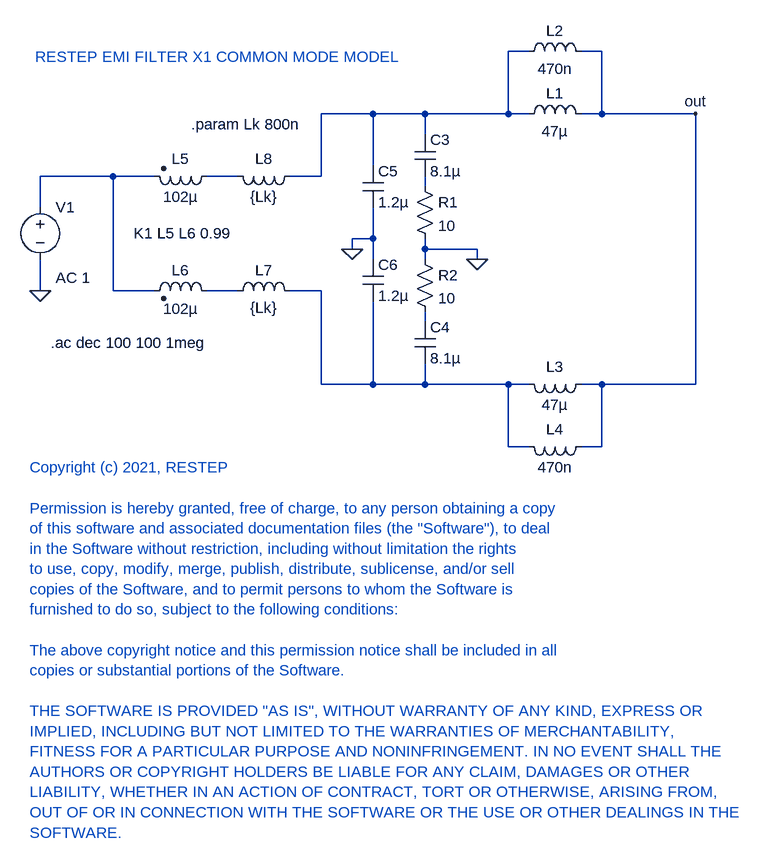
[diagram p0: schematic RESTEP EMI FILTER CM.asc]
RESTEP EMI FILTER CM.asc, the LTspice schematic file:
Version 4
SHEET 1 880 1176
WIRE 128 16 96 16
WIRE 240 16 208 16
WIRE -112 112 -192 112
WIRE -32 112 -112 112
WIRE 96 112 96 16
WIRE 96 112 -32 112
WIRE 128 112 96 112
WIRE 240 112 240 16
WIRE 240 112 208 112
WIRE 384 112 240 112
WIRE -32 144 -32 112
WIRE -112 192 -112 112
WIRE -512 208 -624 208
WIRE -448 208 -512 208
WIRE -320 208 -368 208
WIRE -192 208 -192 112
WIRE -192 208 -240 208
WIRE -32 224 -32 208
WIRE -624 256 -624 208
WIRE -112 304 -112 256
WIRE -112 304 -144 304
WIRE -144 320 -144 304
WIRE -32 320 -32 304
WIRE 48 320 -32 320
WIRE -112 336 -112 304
WIRE -32 336 -32 320
WIRE 48 336 48 320
WIRE -624 384 -624 336
WIRE -512 384 -512 208
WIRE -448 384 -512 384
WIRE -320 384 -368 384
WIRE -192 384 -240 384
WIRE -32 432 -32 416
WIRE -192 528 -192 384
WIRE -112 528 -112 400
WIRE -112 528 -192 528
WIRE -32 528 -32 496
WIRE -32 528 -112 528
WIRE 96 528 -32 528
WIRE 128 528 96 528
WIRE 240 528 208 528
WIRE 384 528 384 112
WIRE 384 528 240 528
WIRE 96 624 96 528
WIRE 128 624 96 624
WIRE 240 624 240 528
WIRE 240 624 208 624
FLAG 384 112 out
FLAG -144 320 0
FLAG 48 336 0
FLAG -624 384 0
SYMBOL ind 112 128 R270
WINDOW 0 32 56 VTop 2
WINDOW 3 5 56 VBottom 2
SYMATTR InstName L1
SYMATTR Value 47µ
SYMATTR SpiceLine Rser=121m
SYMBOL ind 112 32 R270
WINDOW 0 32 56 VTop 2
WINDOW 3 5 56 VBottom 2
SYMATTR InstName L2
SYMATTR Value 470n
SYMATTR SpiceLine Rser=125m
SYMBOL ind 224 512 R90
WINDOW 0 5 56 VBottom 2
WINDOW 3 32 56 VTop 2
SYMATTR InstName L3
SYMATTR Value 47µ
SYMATTR SpiceLine Rser=121m
SYMBOL ind 224 608 R90
WINDOW 0 5 56 VBottom 2
WINDOW 3 32 56 VTop 2
SYMATTR InstName L4
SYMATTR Value 470n
SYMATTR SpiceLine Rser=125m
SYMBOL cap -48 144 R0
SYMATTR InstName C3
SYMATTR Value 8.1µ
SYMBOL cap -48 432 R0
SYMATTR InstName C4
SYMATTR Value 8.1µ
SYMBOL res -48 208 R0
SYMATTR InstName R1
SYMATTR Value 10
SYMBOL res -48 320 R0
SYMATTR InstName R2
SYMATTR Value 10
SYMBOL ind2 -352 192 R90
WINDOW 0 5 56 VBottom 2
WINDOW 3 32 56 VTop 2
SYMATTR InstName L5
SYMATTR Value 102µ
SYMATTR Type ind
SYMATTR SpiceLine Rser=19m
SYMBOL ind2 -352 400 M270
WINDOW 0 32 56 VTop 2
WINDOW 3 4 56 VBottom 2
SYMATTR InstName L6
SYMATTR Value 102µ
SYMATTR Type ind
SYMATTR SpiceLine Rser=19m
SYMBOL voltage -624 240 R0
WINDOW 123 24 124 Left 2
WINDOW 39 0 0 Left 0
SYMATTR Value2 AC 1
SYMATTR InstName V1
SYMATTR Value ""
SYMBOL cap -128 192 R0
SYMATTR InstName C5
SYMATTR Value 1.2µ
SYMBOL cap -128 336 R0
SYMATTR InstName C6
SYMATTR Value 1.2µ
SYMBOL ind -336 400 R270
WINDOW 0 32 56 VTop 2
WINDOW 3 5 56 VBottom 2
SYMATTR InstName L7
SYMATTR Value {Lk}
SYMBOL ind -224 192 R90
WINDOW 0 5 56 VBottom 2
WINDOW 3 32 56 VTop 2
SYMATTR InstName L8
SYMATTR Value {Lk}
TEXT -480 296 Left 2 !K1 L5 L6 0.99
TEXT -608 464 Left 2 !.ac dec 100 100 1meg
TEXT -392 128 Left 2 !.param Lk 800n
TEXT -632 24 Left 2 ;RESTEP EMI FILTER X1 COMMON MODE MODEL
TEXT -640 656 Left 2 ;Copyright (c) 2021, RESTEP\n \nPermission is hereby granted, free of charge, to any person obtaining a copy\nof this software and associated documentation files (the "Software"), to deal\nin the Software without restriction, including without limitation the rights\nto use, copy, modify, merge, publish, distribute, sublicense, and/or sell\ncopies of the Software, and to permit persons to whom the Software is\nfurnished to do so, subject to the following conditions:\n \nThe above copyright notice and this permission notice shall be included in all\ncopies or substantial portions of the Software.\n \nTHE SOFTWARE IS PROVIDED "AS IS", WITHOUT WARRANTY OF ANY KIND, EXPRESS OR\nIMPLIED, INCLUDING BUT NOT LIMITED TO THE WARRANTIES OF MERCHANTABILITY,\nFITNESS FOR A PARTICULAR PURPOSE AND NONINFRINGEMENT. IN NO EVENT SHALL THE\nAUTHORS OR COPYRIGHT HOLDERS BE LIABLE FOR ANY CLAIM, DAMAGES OR OTHER\nLIABILITY, WHETHER IN AN ACTION OF CONTRACT, TORT OR OTHERWISE, ARISING FROM,\nOUT OF OR IN CONNECTION WITH THE SOFTWARE OR THE USE OR OTHER DEALINGS IN THE\nSOFTWARE.

The netlist it stands for:
* RESTEP EMI FILTER CM.asc
L1 N001 out 47µ Rser=121m
L2 N001 out 470n Rser=125m
L3 out N006 47µ Rser=121m
L4 out N006 470n Rser=125m
C3 N001 N004 8.1µ
C4 N007 N006 8.1µ
R1 N004 0 10
R2 0 N007 10
L5 N003 N002 102µ Rser=19m
L6 N005 N002 102µ Rser=19m
V1 N002 0 AC 1
C5 N001 0 1.2µ
C6 0 N006 1.2µ
L7 N005 N006 {Lk}
L8 N001 N003 {Lk}
K1 L5 L6 0.99
.ac dec 100 100 1meg
.param Lk 800n
* RESTEP EMI FILTER X1 COMMON MODE MODEL
* Copyright (c) 2021, RESTEP
* Permission is hereby granted, free of charge, to any person obtaining a copy
* of this software and associated documentation files (the "Software"), to deal
* in the Software without restriction, including without limitation the rights
* to use, copy, modify, merge, publish, distribute, sublicense, and/or sell
* copies of the Software, and to permit persons to whom the Software is
* furnished to do so, subject to the following conditions:
* The above copyright notice and this permission notice shall be included in all
* copies or substantial portions of the Software.
* THE SOFTWARE IS PROVIDED "AS IS", WITHOUT WARRANTY OF ANY KIND, EXPRESS OR
* IMPLIED, INCLUDING BUT NOT LIMITED TO THE WARRANTIES OF MERCHANTABILITY,
* FITNESS FOR A PARTICULAR PURPOSE AND NONINFRINGEMENT. IN NO EVENT SHALL THE
* AUTHORS OR COPYRIGHT HOLDERS BE LIABLE FOR ANY CLAIM, DAMAGES OR OTHER
* LIABILITY, WHETHER IN AN ACTION OF CONTRACT, TORT OR OTHERWISE, ARISING FROM,
* OUT OF OR IN CONNECTION WITH THE SOFTWARE OR THE USE OR OTHER DEALINGS IN THE
* SOFTWARE.
.backanno
.end